# Altium schematic sheet MAZ000164 - Diagrama físico.SchDoc: MAZ000164 - Diagrama físico
size A; ApprovedBy: Christian Ledwidth; CheckedBy: Nahuel Martinez; Author: Santiago Marti; CompanyName: Body Health; DrawnBy: Santiago Marti; Revision: A; SheetNumber: 2; SheetTotal: 2
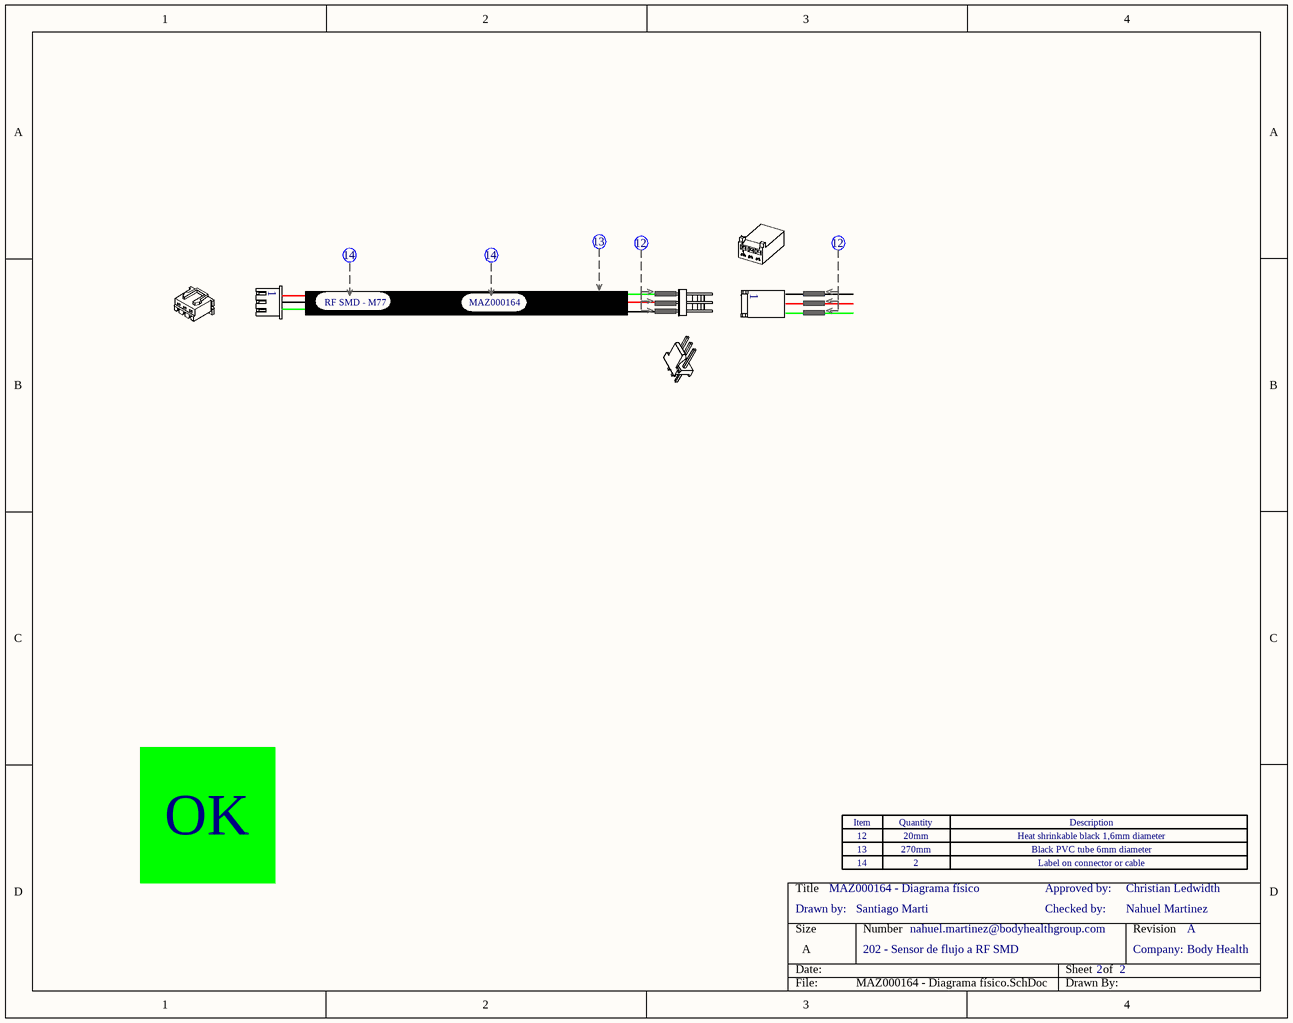
[diagram p0: MAZ000164 - Diagrama físico.SchDoc]

## Parts
(Parts that share a designator on the sheet are numbered #1, #2 ... from top to bottom, then left to right.)
Con1  XHP-3  (value not drawn)  (parts A,B of 4)
Con?#1  CST-100-3  (value not drawn)  (part B of 4)
Con?#2  640456-3  (value not drawn)  (part A of 4)
Con?#3  CST-100-3  (value not drawn)  (part A of 4)
Con?#4  640456-3  (value not drawn)  (part B of 4)
Soc1  sock_XHP_SXH-002T-P0.6  (value not drawn)  (part A of 2)
Soc2  sock_XHP_SXH-002T-P0.6  (value not drawn)  (part A of 2)
Soc3  sock_XHP_SXH-002T-P0.6  (value not drawn)  (part A of 2)
Soc?#1  sock_XHP_SXH-002T-P0.6  (value not drawn)  (part A of 2)
Soc?#2  sock_XHP_SXH-002T-P0.6  (value not drawn)  (part A of 2)
Zoc1  Zócalo_Header  (value not drawn)
Zoc7  Zócalo_Item  (value not drawn)
Zoc8  Zócalo_Item  (value not drawn)
Zoc?  Zócalo_Item  (value not drawn)

## Notes on the sheet
- RF SMD - M77
- (near Soc1) MAZ000164
- OK
- 12
- 20mm
- Heat shrinkable black 1,6mm diameter
- Drawn by:
- 13
- 14
- 270mm
- 2
- Checked by:
- Approved by:
- Black PVC tube 6mm diameter
- Label on connector or cable
- 202 - Sensor de flujo a RF SMD
- nahuel.martinez@bodyhealthgroup.com
- Company:
- (in symbol Zócalo_Header) Item; Quantity; Description

## Library data of the parts
Con1 = XHP-3: CONN HOUSING 2.5MM 3POS; Fabricante: JST Sales America Inc.; Cod.DigiKey: 455-2219-ND; Cod.Fabricante: XHP-3; ComponentLink1Description: Manufacturer Link; ComponentLink1URL: http://www.jst-mfg.com/product/pdf/eng/eXH.pdf; DIGIKEYx50: 0.06220; CallOut: *; DIGIKEYx100: NO
Con?#1 Con?#3 = CST-100-3: CONN RCPT HSNG 3POS CST-100 II; Cod.Fabricante: 1375820-3; Fabricante: TE Connectivity AMP Connectors; Cod.DigiKey: A99614-ND; ComponentLink1Description: Manufacturer Link; ComponentLink1URL: https://www.te.com/commerce/DocumentDelivery/DDEController?Action=srchrtrv&DocNm=1375820&DocType=Customer+Drawing&DocLang=English; DIGIKEYx50: 0.12620; CallOut: *; DIGIKEYx100: 0.11720
Con?#2 Con?#4 = 640456-3: CONN HEADER VERT 3POS 2.54MM; Fabricante: TE Connectivity AMP Connectors; Cod.DigiKey: A19470-ND; Cod.Fabricante: 640456-3; ComponentLink1Description: Manufacturer Link; ComponentLink1URL: https://www.te.com/commerce/DocumentDelivery/DDEController?Action=srchrtrv&DocNm=1375820&DocType=Customer+Drawing&DocLang=English; CallOut: *; DIGIKEYx100: 0.09360
Soc1 Soc3 = sock_XHP_SXH-002T-P0.6: CONN SOCKET 26-30AWG CRIMP TIN; Fabricante: JST Sales America Inc.; CallOut: 14; Cod.DigiKey: 455-2261-1-ND; Cod.Fabricante: SXH-002T-P0.6; ComponentLink1Description: Manufacturer Link; ComponentLink1URL: http://www.jst-mfg.com/product/pdf/eng/eXH.pdf; DIGIKEYx100: 0.03300; DIGIKEYx50: 0.03420
Soc2 = sock_XHP_SXH-002T-P0.6: CONN SOCKET 26-30AWG CRIMP TIN; Fabricante: JST Sales America Inc.; CallOut: 13; Cod.DigiKey: 455-2261-1-ND; Cod.Fabricante: SXH-002T-P0.6; ComponentLink1Description: Manufacturer Link; ComponentLink1URL: http://www.jst-mfg.com/product/pdf/eng/eXH.pdf; DIGIKEYx100: 0.03300; DIGIKEYx50: 0.03420
Soc?#1 Soc?#2 = sock_XHP_SXH-002T-P0.6: CONN SOCKET 26-30AWG CRIMP TIN; Fabricante: JST Sales America Inc.; CallOut: 12; Cod.DigiKey: 455-2261-1-ND; Cod.Fabricante: SXH-002T-P0.6; ComponentLink1Description: Manufacturer Link; ComponentLink1URL: http://www.jst-mfg.com/product/pdf/eng/eXH.pdf; DIGIKEYx100: 0.03300; DIGIKEYx50: 0.03420
Zoc1 = Zócalo_Header: Header para el zócalo de referencias
Zoc7 Zoc8 Zoc? = Zócalo_Item: Ítem para el zócalo de referencias; Desginator: *; Quantity: *; ItemDescription: *